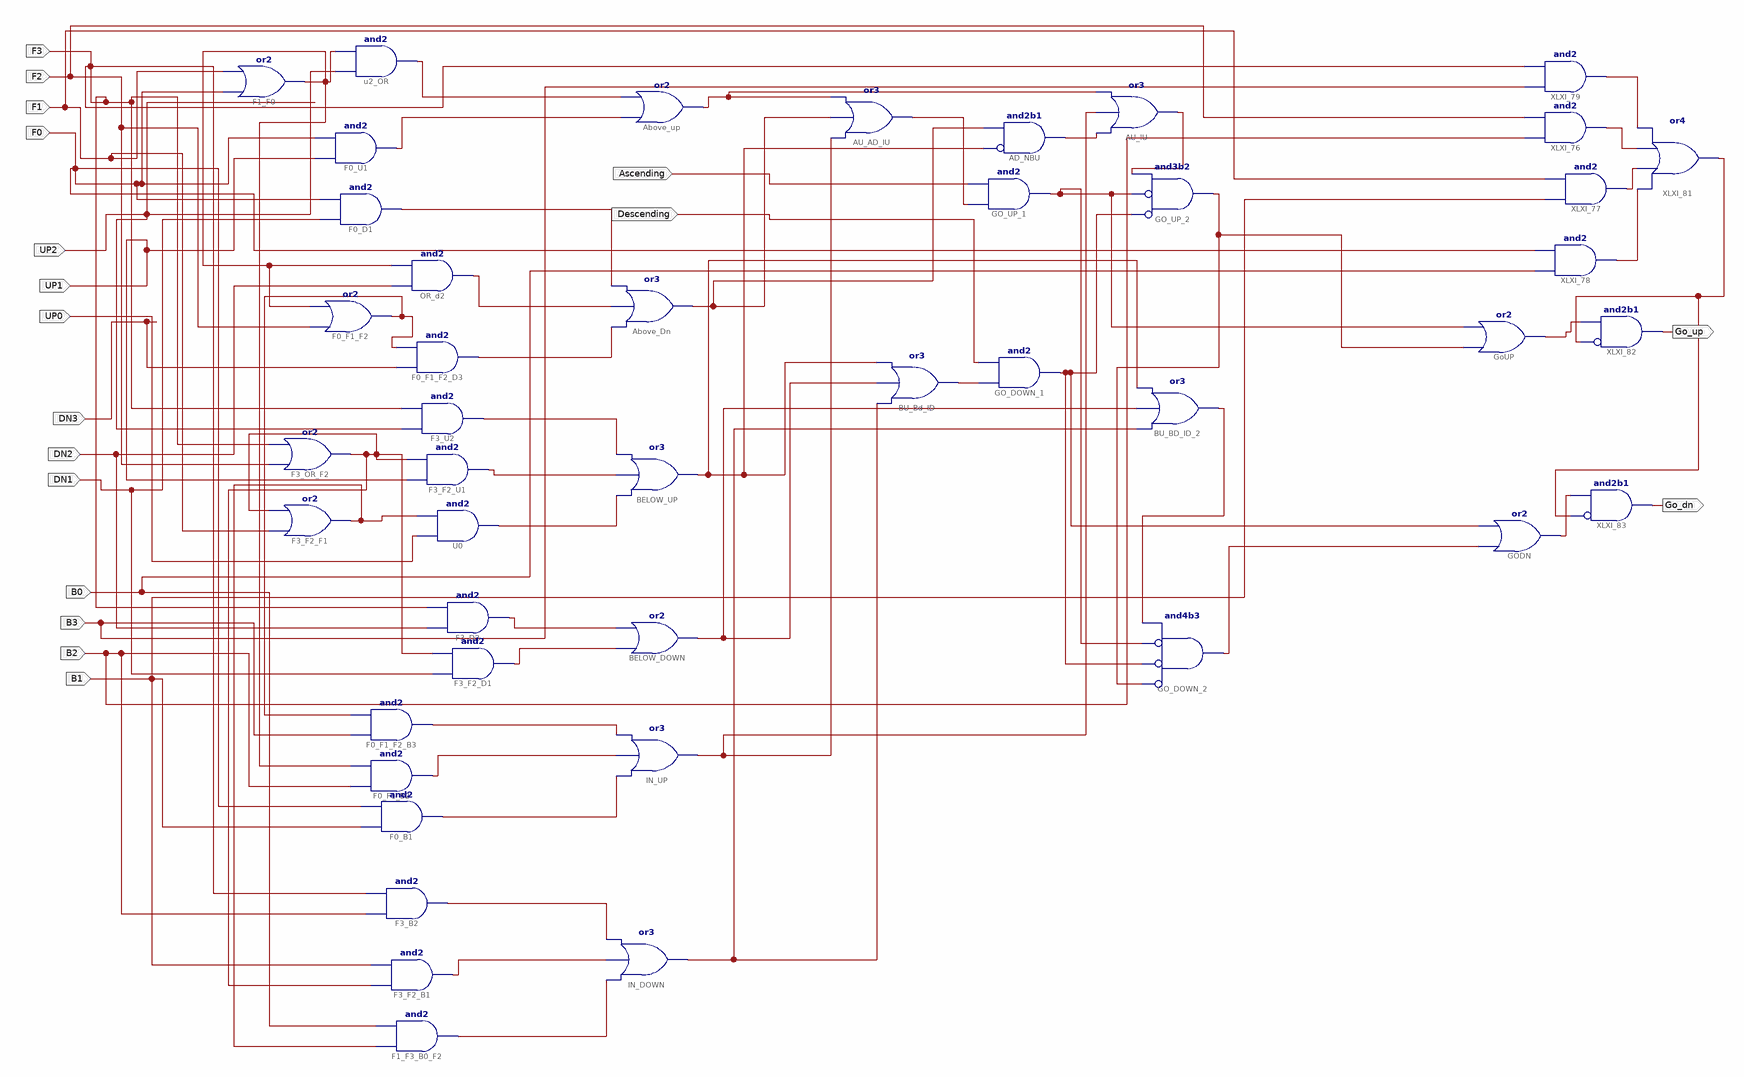
[diagram p0: schematic sheet 1]
// Xilinx ISE schematic lab1.sch (spartan6) as structural Verilog: 44 symbols, 18 ports
module lab1 (
  input  DN1,
  input  DN2,
  input  DN3,
  input  UP0,
  input  UP1,
  input  UP2,
  input  F0,
  input  F1,
  input  F2,
  input  F3,
  input  B1,
  input  B2,
  input  B3,
  input  B0,
  input  Ascending,
  input  Descending,
  output Go_up,
  output Go_dn
);

  wire a, XLXN_21, XLXN_26, XLXN_27, XLXN_34, XLXN_36, XLXN_39, XLXN_53, XLXN_56, XLXN_57, XLXN_58, XLXN_59,
       XLXN_144, XLXN_146, XLXN_147, XLXN_148, XLXN_150, XLXN_152, XLXN_155, XLXN_157, XLXN_158, XLXN_186,
       XLXN_187, XLXN_188, XLXN_199, XLXN_204, XLXN_205, XLXN_206, XLXN_208, XLXN_210, XLXN_211, XLXN_215,
       XLXN_216, XLXN_218, XLXN_225, XLXN_226, XLXN_231, XLXN_232, XLXN_233, XLXN_236, XLXN_239, XLXN_240;

  and U0 (XLXN_59, UP0, XLXN_58);
  or F3_F2_F1 (XLXN_58, F1, XLXN_57);
  or F3_OR_F2 (XLXN_57, F2, F3);
  and F3_F2_U1 (XLXN_56, UP1, XLXN_57);
  and F3_U2 (XLXN_53, UP2, F3);
  or F0_F1_F2 (XLXN_147, F2, XLXN_36);
  and F0_F1_F2_D3 (XLXN_39, DN3, XLXN_147);
  and OR_d2 (XLXN_34, DN2, XLXN_36);
  or Above_Dn (XLXN_186, XLXN_39, XLXN_34, XLXN_27);
  or BELOW_UP (XLXN_206, XLXN_59, XLXN_56, XLXN_53);
  and u2_OR (XLXN_21, UP2, XLXN_36);
  or Above_up (XLXN_205, XLXN_26, XLXN_21);
  and F0_D1 (XLXN_27, DN1, F0);
  and F0_U1 (XLXN_26, UP1, F0);
  or F1_F0 (XLXN_36, F0, F1);
  or BELOW_DOWN (XLXN_215, XLXN_146, XLXN_144);
  and F3_D2 (XLXN_144, DN2, F3);
  and F3_F2_D1 (XLXN_146, DN1, XLXN_57);
  or IN_UP (XLXN_187, XLXN_152, XLXN_150, XLXN_148);
  or IN_DOWN (XLXN_216, XLXN_158, XLXN_157, XLXN_155);
  and F0_F1_F2_B3 (XLXN_148, B3, XLXN_147);
  and F0_F1_B2 (XLXN_150, B2, XLXN_36);
  and F0_B1 (XLXN_152, B1, F0);
  and F3_B2 (XLXN_155, B2, F3);
  and F3_F2_B1 (XLXN_157, XLXN_57, B1);
  and F1_F3_B0_F2 (XLXN_158, XLXN_58, B0);
  and GO_UP_1 (XLXN_225, XLXN_188, Ascending);
  and GO_DOWN_1 (XLXN_210, XLXN_199, Descending);
  or AU_AD_IU (XLXN_188, XLXN_187, XLXN_186, XLXN_205);
  or BU_Bd_ID (XLXN_199, XLXN_216, XLXN_215, XLXN_206);
  and GO_UP_2 (XLXN_211, ~XLXN_210, ~XLXN_225, XLXN_204);  // and3b2
  or AU_IU (XLXN_204, XLXN_208, XLXN_187, XLXN_205);
  and AD_NBU (XLXN_208, ~XLXN_206, XLXN_186);  // and2b1
  and GO_DOWN_2 (XLXN_226, ~XLXN_211, ~XLXN_210, ~XLXN_225, XLXN_218);  // and4b3
  or BU_BD_ID_2 (XLXN_218, XLXN_216, XLXN_215, XLXN_206);
  or GoUP (a, XLXN_211, XLXN_225);
  or GODN (XLXN_240, XLXN_226, XLXN_210);
  and XLXI_76 (XLXN_232, B2, F2);
  and XLXI_77 (XLXN_233, B1, F1);
  and XLXI_78 (XLXN_236, B0, F0);
  and XLXI_79 (XLXN_231, B3, F3);
  or XLXI_81 (XLXN_239, XLXN_236, XLXN_233, XLXN_232, XLXN_231);
  and XLXI_82 (Go_up, ~XLXN_239, a);  // and2b1
  and XLXI_83 (Go_dn, ~XLXN_239, XLXN_240);  // and2b1
endmodule
